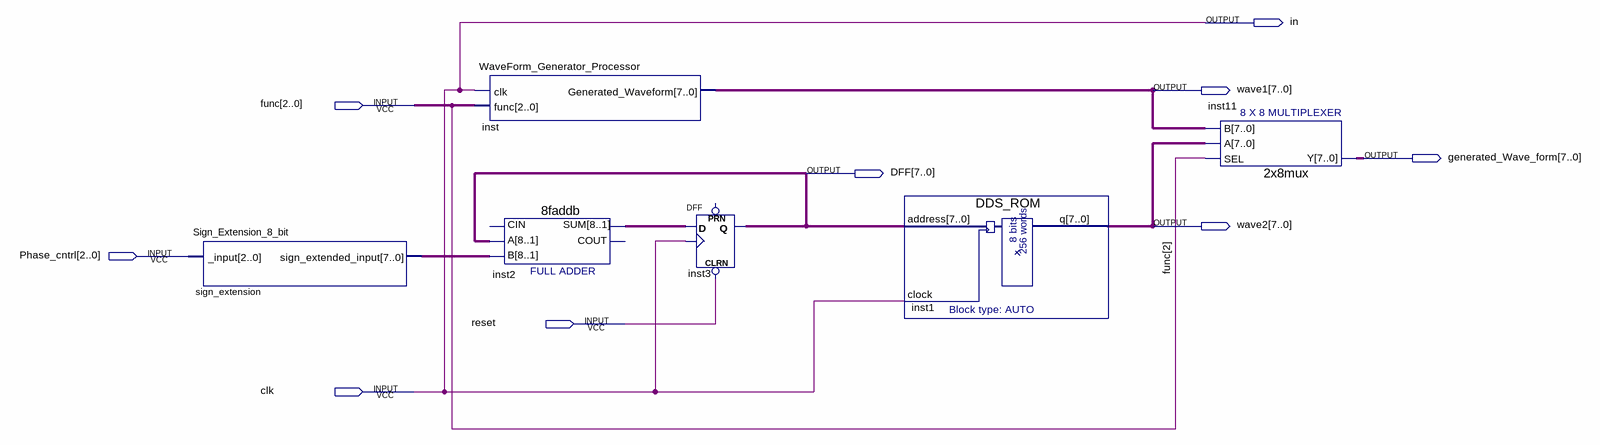
[diagram p0: schematic sheet]
// Quartus schematic DDS.bdf as structural Verilog: 6 symbols, 9 pins
module DDS (
  input  [2:0] func,
  input  [2:0] Phase_cntrl,
  input  reset,
  input  clk,
  output in,
  output [7:0] wave1,
  output [7:0] generated_Wave_form,
  output [7:0] DFF,
  output [7:0] wave2
);

  wire [7:0] inst2_sum, sign_extension_sign_extended_input;

  Sign_Extension_8_bit sign_extension (._input(Phase_cntrl), .sign_extended_input(sign_extension_sign_extended_input));
  WaveForm_Generator_Processor inst (.clk(clk), .func(func), .Generated_Waveform(wave1));
  \8faddb  inst2 (.A(DFF), .B(sign_extension_sign_extended_input), .SUM(inst2_sum));  // open: CIN, COUT
  DFF inst3[7:0] (.CLRN(reset), .CLK(clk), .D(inst2_sum), .Q(DFF));  // open: PRN
  DDS_ROM inst1 (.address(DFF), .clock(clk), .q(wave2));
  \2x8mux  inst11 (.SEL(func[2]), .A(wave2), .B(wave1), .Y(generated_Wave_form));

  assign in = clk;
endmodule
